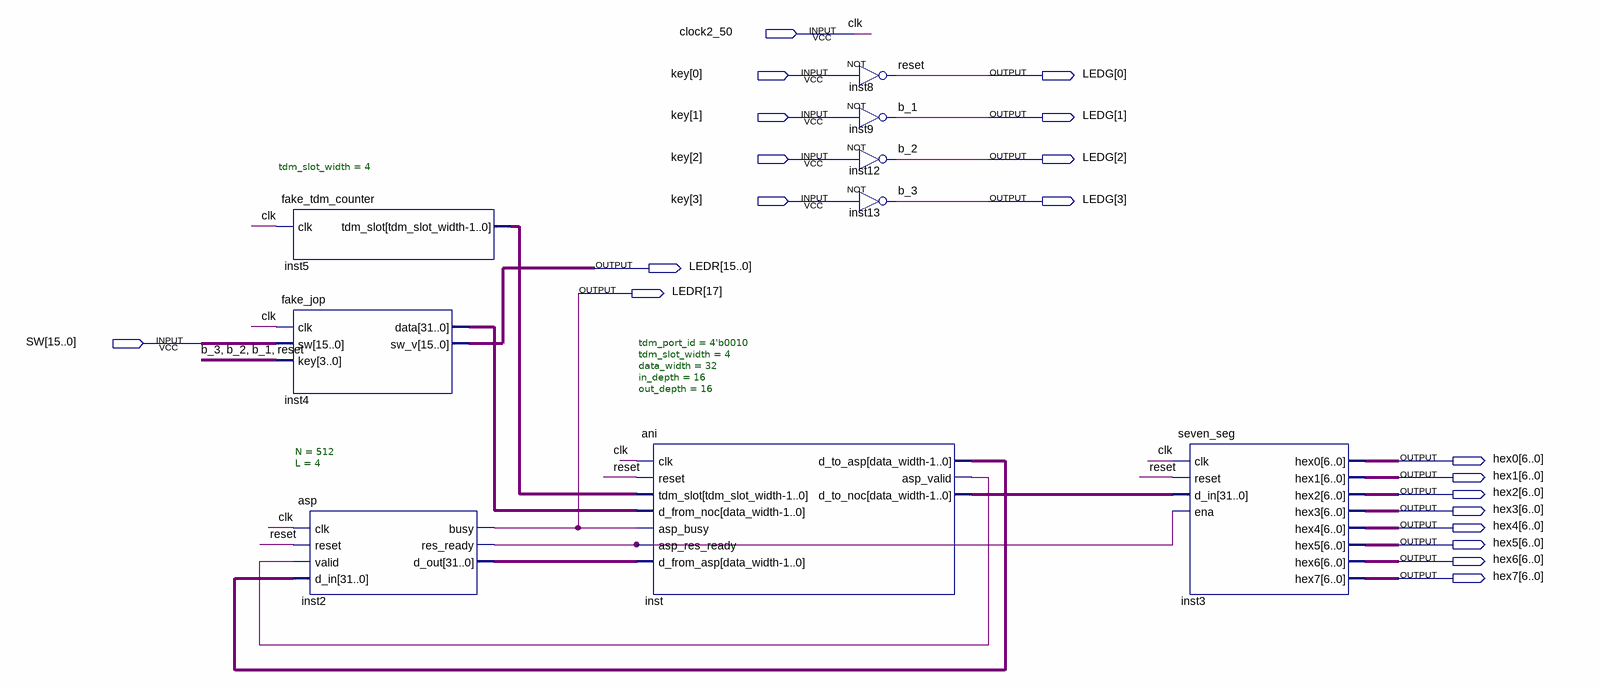
[diagram p0: schematic sheet]
// Quartus schematic test_asp.bdf as structural Verilog: 9 symbols, 20 pins
module test_asp (
  input  clock2_50,
  input  [3:0] key,
  input  [15:0] SW,
  output [3:0] LEDG,
  output [17:0] LEDR,
  output [6:0] hex0,
  output [6:0] hex1,
  output [6:0] hex2,
  output [6:0] hex3,
  output [6:0] hex4,
  output [6:0] hex5,
  output [6:0] hex6,
  output [6:0] hex7
);

  wire inst2_res_ready, inst_asp_valid;
  wire [3:0] inst5_tdm_slot;
  wire [31:0] inst2_d_out, inst4_data, inst_d_to_asp, inst_d_to_noc;

  fake_tdm_counter #(.tdm_slot_width(4)) inst5 (.clk(clock2_50), .tdm_slot(inst5_tdm_slot));
  fake_jop inst4 (.clk(clock2_50), .sw(SW), .key(LEDG), .data(inst4_data), .sw_v(LEDR[15:0]));
  asp #(.N(512), .L(4)) inst2 (
    .clk(clock2_50), .reset(LEDG[0]), .valid(inst_asp_valid), .d_in(inst_d_to_asp), .busy(LEDR[17]),
    .res_ready(inst2_res_ready), .d_out(inst2_d_out));
  ani #(.tdm_port_id(4'b0010), .tdm_slot_width(4), .data_width(32), .in_depth(16), .out_depth(16)) inst (
    .clk(clock2_50), .reset(LEDG[0]), .tdm_slot(inst5_tdm_slot), .d_from_noc(inst4_data),
    .asp_busy(LEDR[17]), .asp_res_ready(inst2_res_ready), .d_from_asp(inst2_d_out), .d_to_asp(inst_d_to_asp),
    .asp_valid(inst_asp_valid), .d_to_noc(inst_d_to_noc));
  not inst8 (LEDG[0], key[0]);
  not inst9 (LEDG[1], key[1]);
  not inst12 (LEDG[2], key[2]);
  not inst13 (LEDG[3], key[3]);
  seven_seg inst3 (
    .clk(clock2_50), .reset(LEDG[0]), .d_in(inst_d_to_noc), .ena(inst2_res_ready), .hex0(hex0), .hex1(hex1),
    .hex2(hex2), .hex3(hex3), .hex4(hex4), .hex5(hex5), .hex6(hex6), .hex7(hex7));

  // Other names for the same wires on the sheet: b_1 = LEDG[1]; b_2 = LEDG[2]; b_3 = LEDG[3]; clk = clock2_50;
  //   reset = LEDG[0]
endmodule
